# Altium project HHKB_3_0.PrjPcb
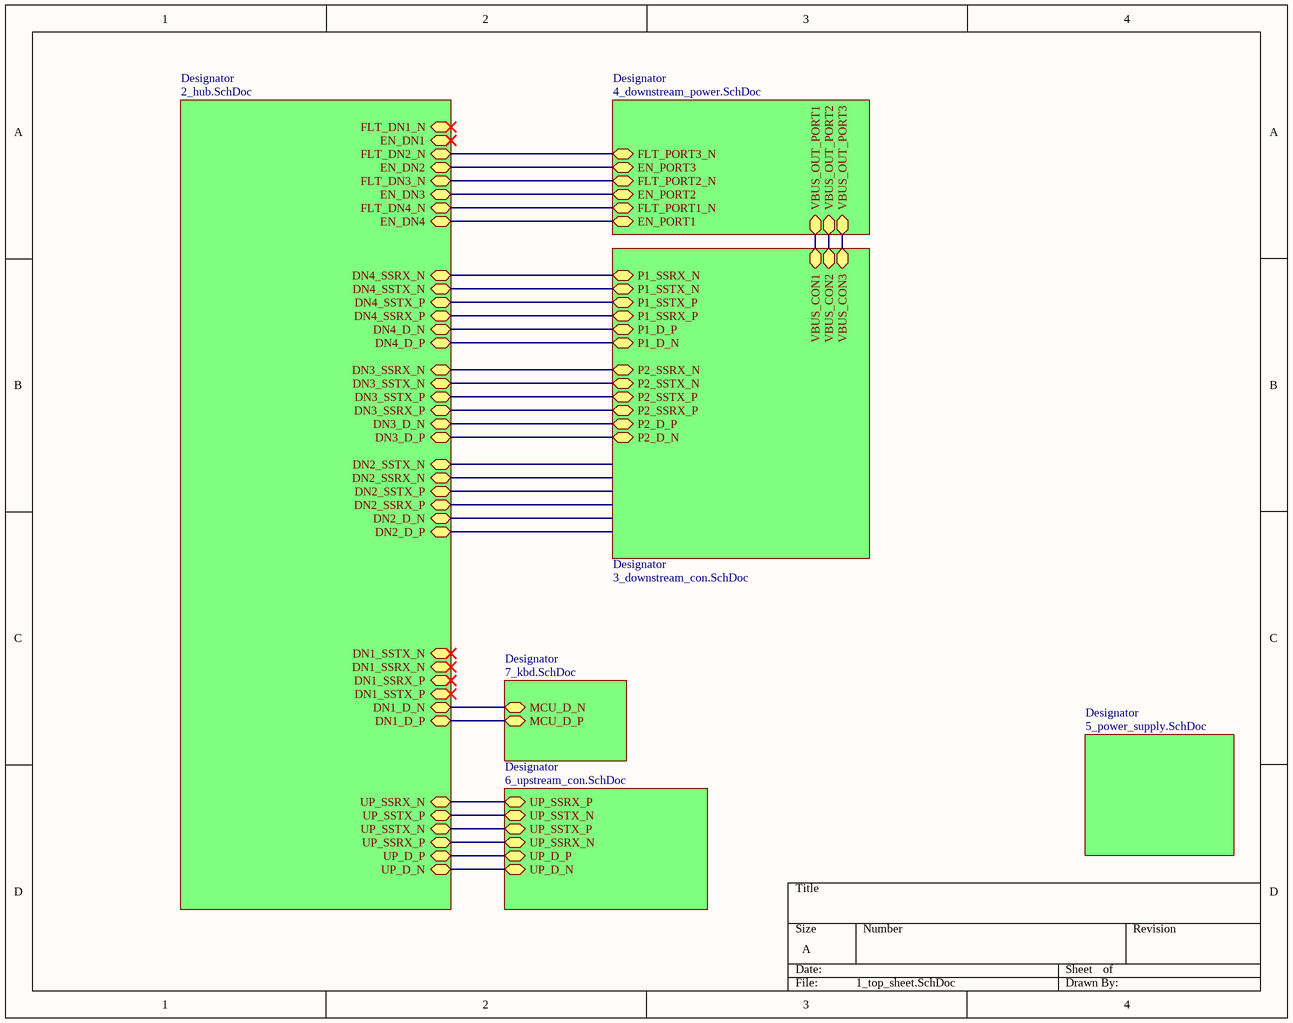
[diagram p0: 1_top_sheet.SchDoc]
4 sheets, 69 parts. Net scope: hierarchical (ports join the sheet entries above them; power ports are global).
Board file: pcb.PcbDoc
Sheets:
  1_top_sheet.SchDoc
    Designator = 4_downstream_power.SchDoc
    Designator = 3_downstream_con.SchDoc
    Designator = 7_kbd.SchDoc

## Sheet 1_top_sheet.SchDoc
size A

### Sub-sheets
Designator = 4_downstream_power.SchDoc: VBUS_OUT_PORT2, FLT_PORT2_N, EN_PORT1, VBUS_OUT_PORT1, FLT_PORT1_N, EN_PORT2, FLT_PORT3_N, VBUS_OUT_PORT3, EN_PORT3
Designator = 2_hub.SchDoc (file not in this document): FLT_DN2_N, EN_DN2, EN_DN3, EN_DN1, FLT_DN3_N, FLT_DN1_N, FLT_DN4_N, EN_DN4, DN4_D_P, DN1_SSRX_N, DN4_D_N, DN4_SSTX_P, DN4_SSTX_N, DN4_SSRX_P, DN4_SSRX_N, UP_SSRX_P, UP_SSRX_N, UP_SSTX_N, UP_SSTX_P, UP_D_N, UP_D_P, DN3_D_P, DN3_SSRX_P, DN3_SSRX_N, DN3_D_N, DN3_SSTX_P, DN3_SSTX_N, DN2_D_P, DN2_D_N, DN2_SSTX_P, DN2_SSTX_N, DN2_SSRX_P, DN2_SSRX_N, DN1_D_P, DN1_D_N, DN1_SSTX_P, DN1_SSTX_N, DN1_SSRX_P
Designator = 3_downstream_con.SchDoc: VBUS_CON1, VBUS_CON2, P2_SSTX_N, P2_SSTX_P, P1_SSTX_N, P1_SSRX_P, P2_SSRX_P, P2_SSRX_N, P1_SSRX_N, P1_D_P, P2_D_N, P2_D_P, P1_SSTX_P, P1_D_N, VBUS_CON3
Designator = 6_upstream_con.SchDoc (file not in this document): UP_SSRX_N, UP_SSTX_N, UP_D_P, UP_D_N, UP_SSRX_P, UP_SSTX_P
Designator = 7_kbd.SchDoc: MCU_D_P, MCU_D_N
Designator = 5_power_supply.SchDoc (file not in this document): no entries

### Nets
D_N: sheet Designator/DN1_D_N, sheet Designator/MCU_D_N
D_P: sheet Designator/DN1_D_P, sheet Designator/MCU_D_P
P1_D_N: sheet Designator/DN4_D_P, sheet Designator/P1_D_N
P1_D_P: sheet Designator/DN4_D_N, sheet Designator/P1_D_P
P1_SSRX_N: sheet Designator/DN4_SSRX_N, sheet Designator/P1_SSRX_N
P1_SSRX_P: sheet Designator/DN4_SSRX_P, sheet Designator/P1_SSRX_P
P1_SSTX_N: sheet Designator/DN4_SSTX_N, sheet Designator/P1_SSTX_N
P1_SSTX_P: sheet Designator/DN4_SSTX_P, sheet Designator/P1_SSTX_P
P2_D_N: sheet Designator/DN3_D_P, sheet Designator/P2_D_N
P2_D_P: sheet Designator/DN3_D_N, sheet Designator/P2_D_P
P2_SSRX_N: sheet Designator/DN3_SSRX_N, sheet Designator/P2_SSRX_N
P2_SSRX_P: sheet Designator/DN3_SSRX_P, sheet Designator/P2_SSRX_P
P2_SSTX_N: sheet Designator/DN3_SSTX_N, sheet Designator/P2_SSTX_N
P2_SSTX_P: sheet Designator/DN3_SSTX_P, sheet Designator/P2_SSTX_P
NetC403_2: sheet Designator/VBUS_OUT_PORT1, sheet Designator/VBUS_CON1
NetC406_2: sheet Designator/VBUS_OUT_PORT2, sheet Designator/VBUS_CON2
NetR401_1: sheet Designator/EN_PORT1, sheet Designator/EN_DN4
NetR403_1: sheet Designator/EN_PORT2, sheet Designator/EN_DN3
NetU401_4: sheet Designator/FLT_PORT1_N, sheet Designator/FLT_DN4_N
NetU402_4: sheet Designator/FLT_PORT2_N, sheet Designator/FLT_DN3_N
(unnamed): sheet Designator/FLT_PORT3_N, sheet Designator/FLT_DN2_N
(unnamed): sheet Designator/VBUS_OUT_PORT3, sheet Designator/VBUS_CON3
(unnamed): sheet Designator/EN_PORT3, sheet Designator/EN_DN2
(unnamed): sheet Designator/UP_SSRX_P, sheet Designator/UP_SSRX_N
(unnamed): sheet Designator/UP_SSRX_N, sheet Designator/UP_SSRX_P
(unnamed): sheet Designator/UP_SSTX_N, sheet Designator/UP_SSTX_P
(unnamed): sheet Designator/UP_SSTX_P, sheet Designator/UP_SSTX_N
(unnamed): sheet Designator/UP_D_N, sheet Designator/UP_D_N
(unnamed): sheet Designator/UP_D_P, sheet Designator/UP_D_P

## Sheet 4_downstream_power.SchDoc
size A
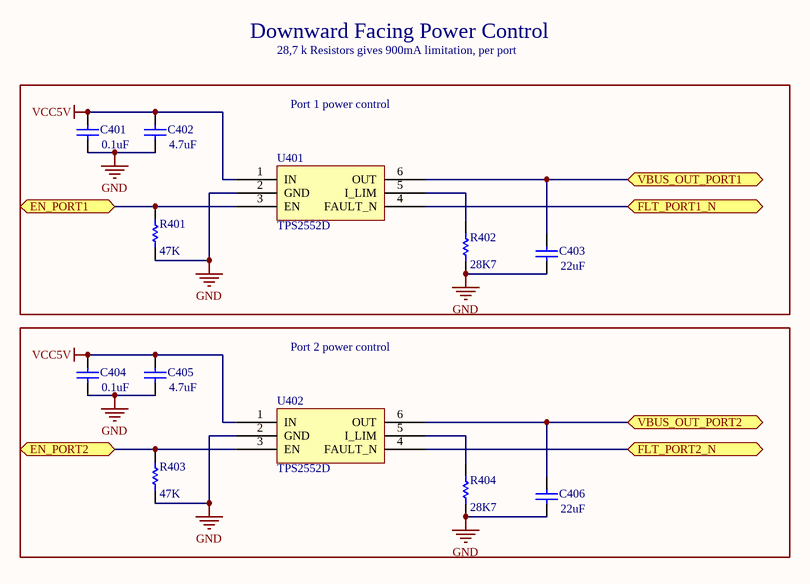
[diagram p1: 4_downstream_power.SchDoc]

### Parts
C401  value 0.1uF  [C0603[1608]]
C402  value 4.7uF  [C1206[3216]]
C403  value 22uF  [C1206[3216]]
C404  value 0.1uF  [C0603[1608]]
C405  value 4.7uF  [C1206[3216]]
C406  value 22uF  [C1206[3216]]
R401  value 47K  [R0603[1608]]
R402  value 28K7  [R0603[1608]]
R403  value 47K  [R0603[1608]]
R404  value 28K7  [R0603[1608]]
U401  TPS2552D  [SOT-23-6]
U402  TPS2552D  [SOT-23-6]

### Blocks framed on the sheet
Port 1 power control: C401-C403 R401 R402 U401
Port 2 power control: C404-C406 R403 R404 U402

### Ports
EN_PORT1, EN_PORT2, FLT_PORT1_N, FLT_PORT2_N, VBUS_OUT_PORT1, VBUS_OUT_PORT2

### Nets
GND: C401.1 C402.1 C403.1 C404.1 C405.1 C406.1 R401.2 R402.2 R403.2 R404.2 U401.2(GND) U402.2(GND)
VCC5V: C401.2 C402.2 C404.2 C405.2 U401.1(IN) U402.1(IN)
NetC403_2: C403.2 U401.6(OUT) ; port VBUS_OUT_PORT1
NetC406_2: C406.2 U402.6(OUT) ; port VBUS_OUT_PORT2
NetR401_1: R401.1 U401.3(EN) ; port EN_PORT1
NetR402_1: R402.1 U401.5(I_LIM)
NetR403_1: R403.1 U402.3(EN) ; port EN_PORT2
NetR404_1: R404.1 U402.5(I_LIM)
NetU401_4: U401.4(FAULT_N) ; port FLT_PORT1_N
NetU402_4: U402.4(FAULT_N) ; port FLT_PORT2_N

### Notes on the sheet
- Downward Facing Power Control
- 28,7 k Resistors gives 900mA limitation, per port

### Library data of the parts
C401 C404 = Cap: Capacitor; MFG: KEMET; MFGPN: C0603C104M5RACTU; Version: 0603 imperial
C402 C405 = Cap: Capacitor; MFG: KEMET; MFGPN: C1206C475K4PACTU; Version: 1206 imperial
C403 C406 = Cap: Capacitor; MFG: KEMET; MFGPN: C1206C226M8RACTU; Version: 1206 imperial
R401 R403 = Res1: Resistor; MFG: Vishay Dale; MFGPN: RCA060347K0FKEA; Version: 0603 imperial
R402 R404 = Res1: Resistor; MFG: Vishay Dale; MFGPN: CRCW060328K7FKEA; Version: 0603 imperial
U401 U402 = TPS2552D: MFG: Texas Instruments; MFGPN: TPS2552DBVR

## Sheet 3_downstream_con.SchDoc
size A
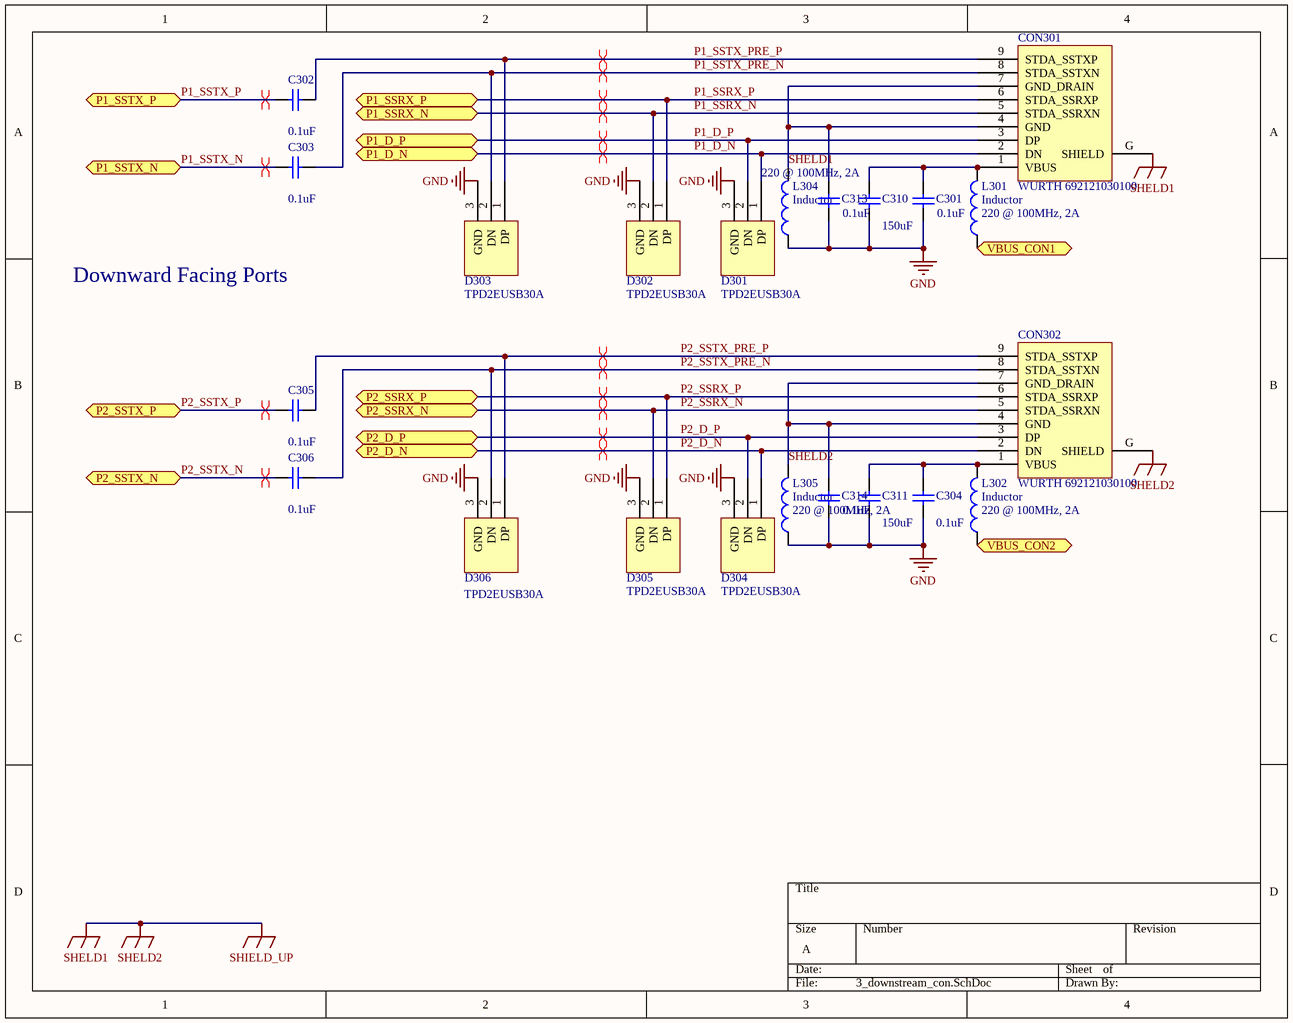
[diagram p2: 3_downstream_con.SchDoc]

### Parts
C301  value 0.1uF  [C0603[1608]]
C302  value 0.1uF  [C0402[1005]]
C303  value 0.1uF  [C0402[1005]]
C304  value 0.1uF  [C0603[1608]]
C305  value 0.1uF  [C0402[1005]]
C306  value 0.1uF  [C0402[1005]]
C310  value 150uF  [C_9G_9H]
C311  value 150uF  [C_9G_9H]
C313  value 0.1uF  [C0603[1608]]  (no BOM)
C314  value 0.1uF  [C0603[1608]]  (no BOM)
CON301  WURTH 692121030100  [WURTH 692122030100]
CON302  WURTH 692121030100  [WURTH 692122030100]
D301  TPD2EUSB30A  [TPD2EUSB30A]
D302  TPD2EUSB30A  [TPD2EUSB30A]
D303  TPD2EUSB30A  [TPD2EUSB30A]
D304  TPD2EUSB30A  [TPD2EUSB30A]
D305  TPD2EUSB30A  [TPD2EUSB30A]
D306  TPD2EUSB30A  [TPD2EUSB30A]
L301  Inductor  value 220 @ 100MHz, 2A  [L0603[1608]]
L302  Inductor  value 220 @ 100MHz, 2A  [L0603[1608]]
L304  Inductor  value 220 @ 100MHz, 2A  [L0603[1608]]
L305  Inductor  value 220 @ 100MHz, 2A  [L0603[1608]]

### Ports
P1_D_N, P1_D_P, P1_SSRX_N, P1_SSRX_P, P1_SSTX_N, P1_SSTX_P, P2_D_N, P2_D_P, P2_SSRX_N, P2_SSRX_P, P2_SSTX_N, P2_SSTX_P, VBUS_CON1, VBUS_CON2

### Nets
GND: C301.1 C304.1 C310.1 C311.1 C313.1 C314.1 D301.3(GND) D302.3(GND) D303.3(GND) D304.3(GND) D305.3(GND) D306.3(GND) L304.1 L305.1
SHELD1: C313.2 C314.2 CON301.4(GND) CON301.7(GND_DRAIN) CON301.G(SHIELD) CON302.4(GND) CON302.7(GND_DRAIN) CON302.G(SHIELD) L304.2 L305.2  [also labelled SHELD2, SHIELD_UP]
P1_D_N: CON301.2(DN) D301.1(DP) ; port P1_D_N
P1_D_P: CON301.3(DP) D301.2(DN) ; port P1_D_P
P1_SSRX_N: CON301.5(STDA_SSRXN) D302.2(DN) ; port P1_SSRX_N
P1_SSRX_P: CON301.6(STDA_SSRXP) D302.1(DP) ; port P1_SSRX_P
P1_SSTX_N: C303.2 ; port P1_SSTX_N
P1_SSTX_P: C302.2 ; port P1_SSTX_P
P1_SSTX_PRE_N: C303.1 CON301.8(STDA_SSTXN) D303.2(DN)
P1_SSTX_PRE_P: C302.1 CON301.9(STDA_SSTXP) D303.1(DP)
P2_D_N: CON302.2(DN) D304.1(DP) ; port P2_D_N
P2_D_P: CON302.3(DP) D304.2(DN) ; port P2_D_P
P2_SSRX_N: CON302.5(STDA_SSRXN) D305.2(DN) ; port P2_SSRX_N
P2_SSRX_P: CON302.6(STDA_SSRXP) D305.1(DP) ; port P2_SSRX_P
P2_SSTX_N: C306.1 ; port P2_SSTX_N
P2_SSTX_P: C305.1 ; port P2_SSTX_P
P2_SSTX_PRE_N: C306.2 CON302.8(STDA_SSTXN) D306.2(DN)
P2_SSTX_PRE_P: C305.2 CON302.9(STDA_SSTXP) D306.1(DP)
NetC301_2: C301.2 C310.2 CON301.1(VBUS) L301.2
NetC304_2: C304.2 C311.2 CON302.1(VBUS) L302.2
NetC403_2: L301.1 ; port VBUS_CON1
NetC406_2: L302.1 ; port VBUS_CON2

### Layout directives
differential pair: P1_D_N, P1_D_P, P1_SSRX_N, P1_SSRX_P, P1_SSTX_N, P1_SSTX_P, P1_SSTX_PRE_N, P1_SSTX_PRE_P, P2_D_N, P2_D_P, P2_SSRX_N, P2_SSRX_P, P2_SSTX_N, P2_SSTX_P, P2_SSTX_PRE_N, P2_SSTX_PRE_P

### Notes on the sheet
- Downward Facing Ports

### Library data of the parts
C301 C304 C313 C314 = Cap: as C401 on sheet 4_downstream_power; Version: 0603 imperial
C302 C303 C305 C306 = Cap: Capacitor; MFG: KEMET; MFGPN: C0402C104K8PACTU; Version: 0402 imperial
C310 C311 = Cap: Capacitor; MFG: United Chemi-Con; MFGPN: EMVA100ADA151MF55G; Version: SMD - 9G or 9H
CON301 CON302 = WURTH 692121030100: MFGPN: 692122030100; MFG: Wurth Electronics Inc
D301-D305 = TPD2EUSB30A: MFG: Texas Instruments; MFGPN: TPD2EUSB30ADRTR
D306 = TPD2EUSB30A: MFGPN: TPD2EUSB30ADRTR; MFG: Texas Instruments
L301 L302 L304 L305 = Inductor: MFG: Murata Electronics North America; MFGPN: BLM18KG221SN1D; Version: 0603 imperial

## Sheet 7_kbd.SchDoc
size A
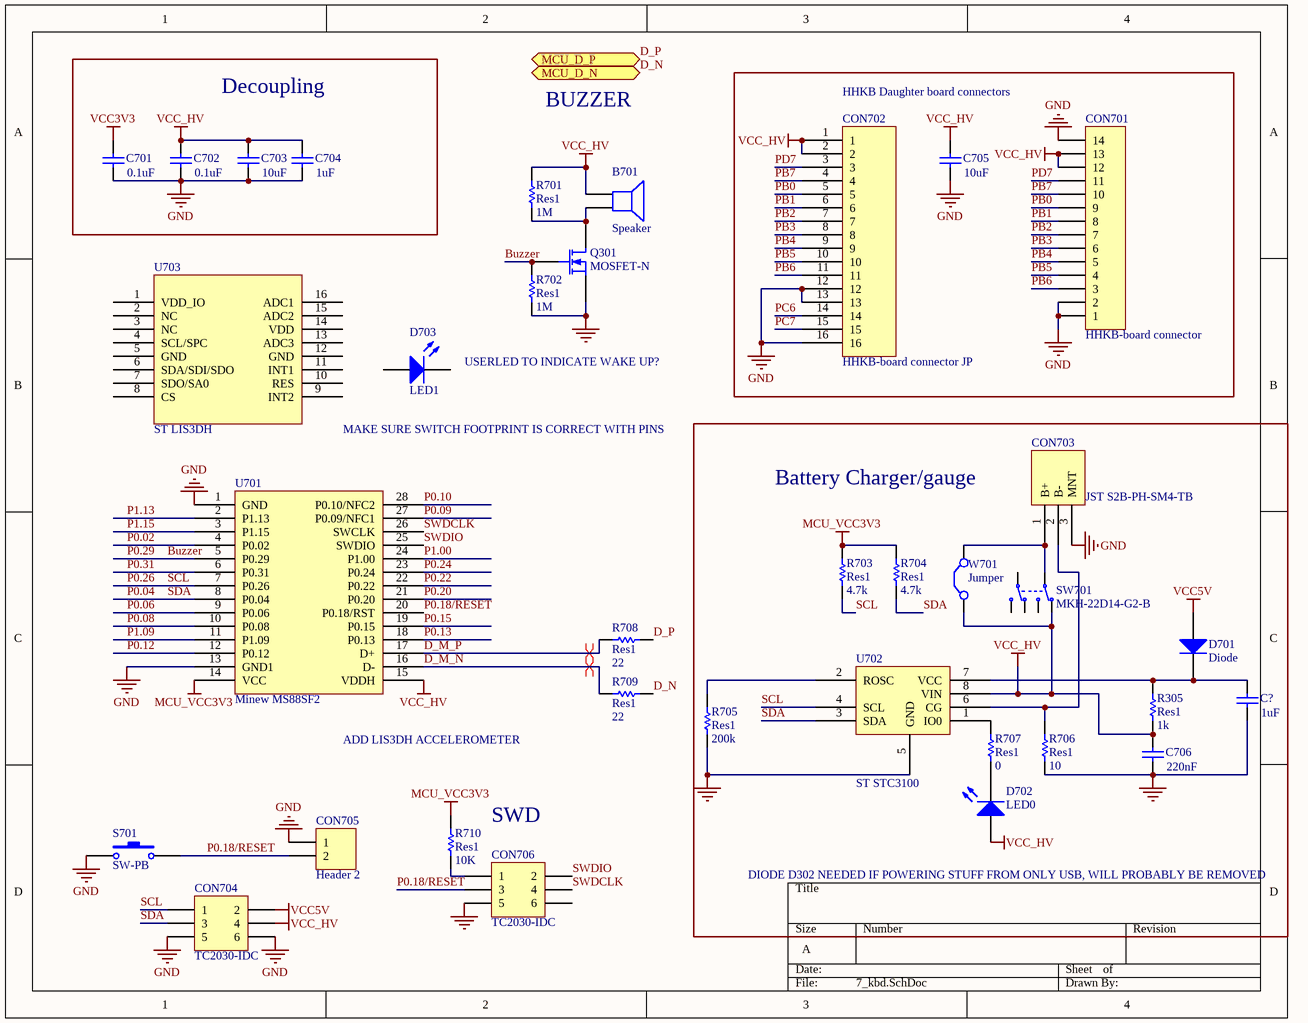
[diagram p3: 7_kbd.SchDoc]

### Parts
B701  Speaker  [buzzer 12x12]
C701  value 0.1uF  [C0603[1608]]
C702  value 0.1uF  [C0603[1608]]
C703  value 10uF  [C1206[3216]]
C704  value 1uF  [C0603[1608]]
C705  value 10uF  [C1206[3216]]
C706  value 220nF  [C0603[1608]]
C?  value 1uF  [C0603[1608]]
CON701  HHKB-board connector  [JST S13B-ZR-SM4A-TF(LF)(SN)]
CON702  HHKB-board connector JP  [DF14A-15P-1.25H]
CON703  JST S2B-PH-SM4-TB  [JST S2B-PH-SM4-TB]
CON704  TC2030-IDC  [TC2030-IDC-NL]  (no BOM)
CON705  Header 2  [HDR1X2]
CON706  TC2030-IDC  [TC2030-IDC-NL]  (no BOM)
D701  Diode  [D0603[1608]]
D702  LED0  [LED0603[1608]]
D703  LED1  [LED-1]
Q301  MOSFET-N  [SOT-23-3]
R305  Res1  value 1k  [R0603[1608]]
R701  Res1  value 1M  [R0603[1608]]
R702  Res1  value 1M  [R0603[1608]]
R703  Res1  value 4.7k  [R0603[1608]]
R704  Res1  value 4.7k  [R0603[1608]]
R705  Res1  value 200k  [R0603[1608]]
R706  Res1  value 10  [R0603[1608]]
R707  Res1  value 0  [R0603[1608]]
R708  Res1  value 22  [R0603[1608]]
R709  Res1  value 22  [R0603[1608]]
R710  Res1  value 10K  [R0603[1608]]
S701  SW-PB  [Wurth 431256038736]
SW701  MKH-22D14-G2-B  [NIDEC CL-SB-22C-02]
U701  Minew MS88SF2  [Minew MS88SF2]
U702  ST STC3100  [STC3100 MiniSO-8]
U703  ST LIS3DH  [ST LIS3DH]
W701  Jumper  [R0603[1608]]

### Blocks framed on the sheet
Decoupling: C701-C704
HHKB Daughter board connectors: C705 CON701 CON702
Battery Charger/gauge: C706 C? CON703 D701 D702 R305 R703-R707 SW701 U702 W701

### Ports
MCU_D_N, MCU_D_P

### Nets
GND: C701.1 C702.1 C703.1 C704.1 C705.1 C706.1 C?.1 CON701.1 CON701.2 CON701.14 CON702.12 CON702.13 CON702.16 CON703.3(MNT) CON704.5 CON704.6 CON705.1 CON706.5 Q301.2(S) R702.2 R705.2 R706.2 S701.2 S701.3(GND) U701.1(GND) U701.13(GND1) U702.5(GND)
MCU_VCC3V3: R703.1 R704.1 R710.1 U701.14(VCC)
VCC3V3: C701.2
VCC5V: CON704.2 D701.1(A)
VCC_HV: B701.1 C702.2 C703.2 C704.2 C705.2 C706.2 CON701.12 CON701.13 CON702.1 CON702.2 CON704.4 D702.1(A) R305.2 R701.1 SW701.3(N.C-1) U701.15(VDDH) U702.8(VIN) W701.1(C1)
Buzzer: Q301.1(G) R702.1 U701.5(P0.29)  [also labelled P0.29]
D_M_N: R709.2 U701.16(D-)
D_M_P: R708.2 U701.17(D+)
D_N: R709.1 ; port MCU_D_N
D_P: R708.1 ; port MCU_D_P
P0.02: U701.4(P0.02)
P0.04: CON704.3 R704.2 U701.8(P0.04) U702.3(SDA)  [also labelled SDA]
P0.06: U701.9(P0.06)
P0.08: U701.10(P0.08)
P0.09: U701.27(P0.09/NFC1)
P0.10: U701.28(P0.10/NFC2)
P0.12: U701.12(P0.12)
P0.13: U701.18(P0.13)
P0.15: U701.19(P0.15)
P0.18/RESET: CON705.2 CON706.3 S701.1 U701.20(P0.18/RST)
P0.20: U701.21(P0.20)
P0.22: U701.22(P0.22)
P0.24: U701.23(P0.24)
P0.26: CON704.1 R703.2 U701.7(P0.26) U702.4(SCL)  [also labelled SCL]
P0.31: U701.6(P0.31)
P1.00: U701.24(P1.00)
P1.09: U701.11(P1.09)
P1.13: U701.2(P1.13)
P1.15: U701.3(P1.15)
PB0: CON701.9 CON702.5
PB1: CON701.8 CON702.6
PB2: CON701.7 CON702.7
PB3: CON701.6 CON702.8
PB4: CON701.5 CON702.9
PB5: CON701.4 CON702.10
PB6: CON701.3 CON702.11
PB7: CON701.10 CON702.4
PC6: CON702.14
PC7: CON702.15
PD7: CON701.11 CON702.3
SWDCLK: CON706.4 U701.26(SWCLK)
SWDIO: CON706.2 U701.25(SWDIO)
NetB701_2: B701.2 Q301.3(D) R701.2
NetC?_2: C?.2 D701.2(K) R305.1 U702.7(VCC)
NetCON703_1: CON703.1(B+) SW701.2(COM-1) W701.2(C2)
NetCON703_2: CON703.2(B-) R706.1 U702.6(CG)
NetCON706_1: CON706.1 R710.2
NetD702_2: D702.2(K) R707.1
NetR705_1: R705.1 U702.2(ROSC)
NetR707_2: R707.2 U702.1(IO0)

Not connected (* = marked no-connect by the designer): CON706 6; D703 1(A) 2(K); SW701 1(N.O-1) 4(N.O-2) 5(COM-2) 6(N.C-2); U703 1(VDD_IO) 2(NC) 3(NC) 4(SCL/SPC) 5(GND) 6(SDA/SDI/SDO) 7(SDO/SA0) 8(CS) 9(INT2) 10(RES) 11(INT1) 12(GND) 13(ADC3) 14(VDD) 15(ADC2) 16(ADC1)

### Layout directives
differential pair: D_M_N, D_M_P

### Notes on the sheet
- BUZZER
- USERLED TO INDICATE WAKE UP?
- MAKE SURE SWITCH FOOTPRINT IS CORRECT WITH PINS
- ADD LIS3DH ACCELEROMETER
- SWD
- DIODE D302 NEEDED IF POWERING STUFF FROM ONLY USB, WILL PROBABLY BE REMOVED

### Library data of the parts
B701 = Speaker: Loudspeaker; LCSC MFG: KELIKING; MFG: Murata Electronics; MFGPN: PKLCS1212E4001-R1; LCSCPN: C201042; MRF.Part: KLJ-1230; Version: 12x12mm buzzer
C701 C702 = Cap: Capacitor; MRF.Part: CC0603KRX7R9BB104; MFG: KEMET; MFGPN: C0603C104M5RACTU; LCSC MFG: YAGEO; Version: 0603 imperial; LCSCPN: C14663
C703-C705 = Cap: Capacitor; MRF.Part: 1206B475K500NT; MFG: KEMET; MFGPN: C0603C104M5RACTU; LCSC MFG: Guangdong Fenghua Advanced Tech; Version: 1206 imperial; LCSCPN: C29823
C706 C? = Cap: Capacitor; Version: 0603 imperial
CON701 = Header 14: MFGPN: S13B-ZR-SM4A-TF(LF)(SN); MFG: JST Sales America Inc
CON702 = DF14A-15P-1.25H: MFG: Hirose Electric Co Ltd; MFGPN: DF14A-15P-1.25H(26)
CON703 = JST S2B-PH-SM4-TB: MFGPN: S2B-PH-SM4-TB(LF)(SN); MFG: JST Sales America Inc.
CON704 CON706 = Header 3X2: Header, 3-Pin, Dual row
CON705 = Header 2: Header, 2-Pin
D701 = Diode: Default Diode; MFG: Bourns Inc.; MFGPN: CD0603-B0340R; Version: 0603 imperial; LCSCPN: C189957
D702 = LED0: Typical INFRARED GaAs LED
D703 = LED1: Typical RED GaAs LED; Published: 8-Jun-2000; LatestRevisionDate: 08-Jul-2005; LatestRevisionNote: Mech Layer 1 removed.; PackageReference: LED-1; Publisher: Altium Limited; PackageDescription: LED; 2 Leads
Q301 = MOSFET-N: N-Channel MOSFET; MFGPN: BSS138; MFG: ON Semiconductor
R305 R703-R709 = Res1: Resistor; Version: 0603 imperial
R701 R702 R710 = Res1: Resistor; MFG: Panasonic Electronic Components; MFGPN: ERJ-3EKF5101V; Version: 0603 imperial
S701 = SW-PB: Switch; MFGPN: 431256038736; MFG: Wurth Electronics Inc
SW701 = MKH-22D14-G2-B: Slide Switch DPDT; Value: MKH-22D14-G2-B
W701 = Jumper: Jumper Wire

## Nets that join several sheets
GND: 4_downstream_power (12 pins), 3_downstream_con (14 pins), 7_kbd (27 pins)
VCC5V: 4_downstream_power (6 pins), 7_kbd (CON704.2 D701.1)
NetC403_2: 4_downstream_power (C403.2 U401.6), 3_downstream_con (L301.1)
NetC406_2: 4_downstream_power (C406.2 U402.6), 3_downstream_con (L302.1)